# Altium schematic sheet LVDS_Receiver_CVN_CLK.SchDoc
size A4; DocumentNumber: 6; SheetNumber: 6; SheetTotal: 11
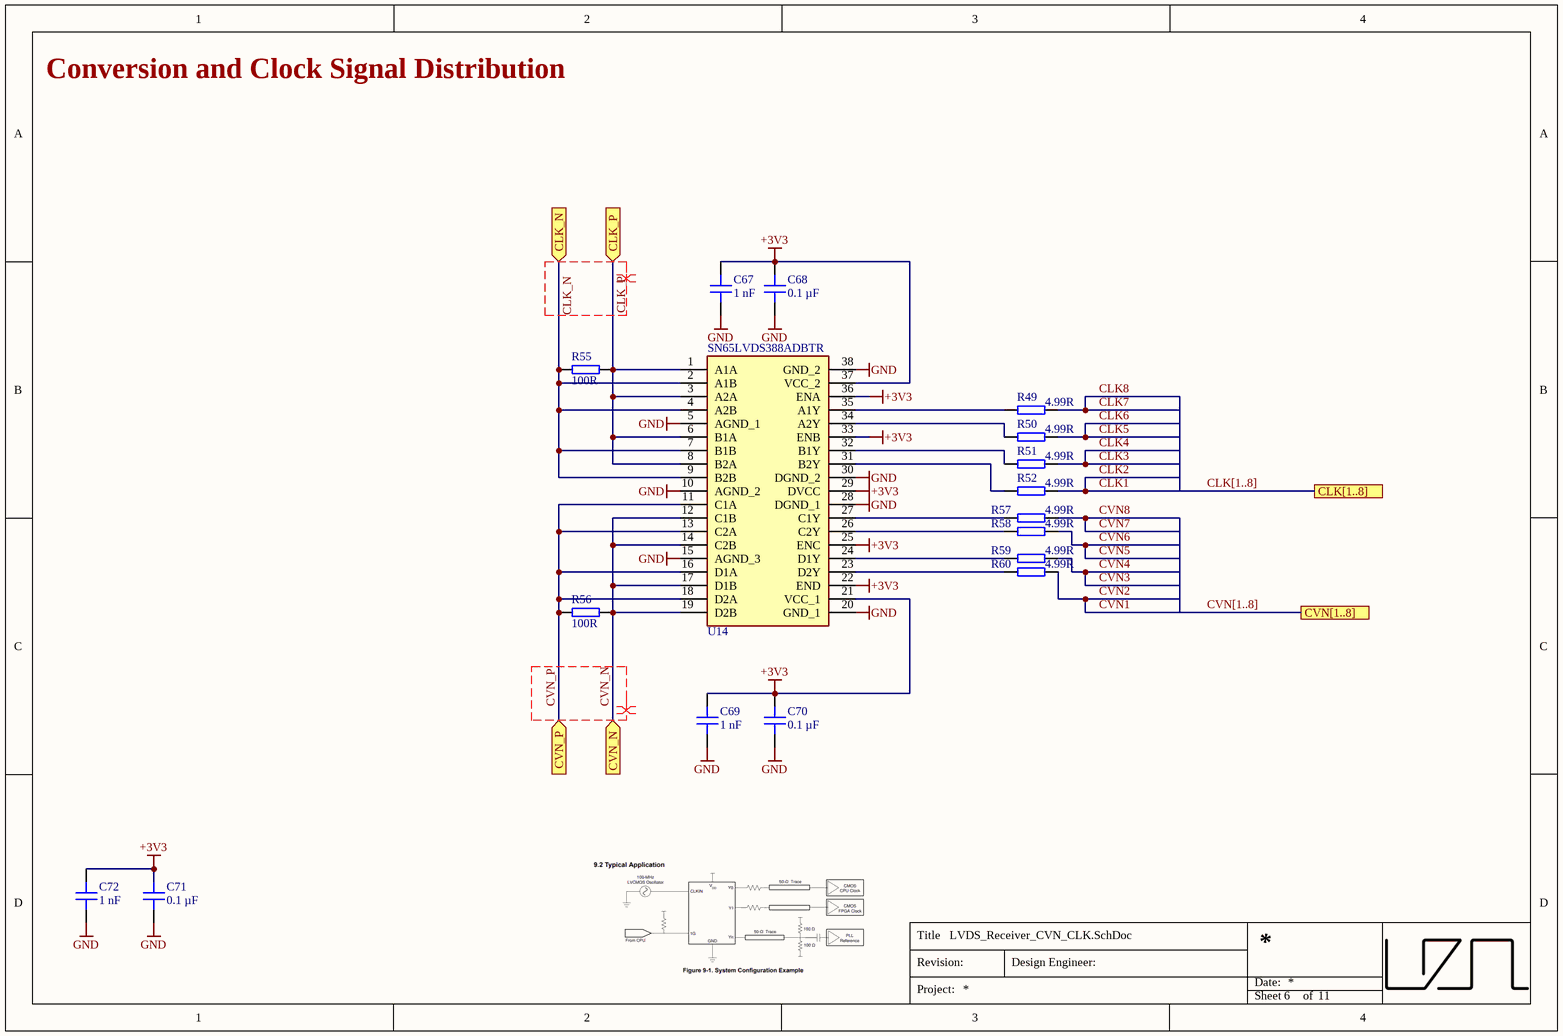
[diagram p0: LVDS_Receiver_CVN_CLK.SchDoc]

## Parts
C67  1 nF  [C_1206]
C68  0.1 µF  [C_0603]
C69  1 nF  [C_1206]
C70  0.1 µF  [C_0603]
C71  0.1 µF  [C_0603]
C72  1 nF  [C_1206]
R49  4.99R  [RES 0603_1608]
R50  4.99R  [RES 0603_1608]
R51  4.99R  [RES 0603_1608]
R52  4.99R  [RES 0603_1608]
R55  100R  [RES 0603_1608]
R56  100R  [RES 0603_1608]
R57  4.99R  [RES 0603_1608]
R58  4.99R  [RES 0603_1608]
R59  4.99R  [RES 0603_1608]
R60  4.99R  [RES 0603_1608]
U14  SN65LVDS388ADBTR  [SOP50P640X120-38N]

## Ports
CLK[1..8], CLK_N (in), CLK_P (in), CVN[1..8], CVN_N (in), CVN_P (in)

## Nets
+3V3: C67.2 C68.1 C69.2 C70.1 C71.1 C72.2 U14.21(VCC_1) U14.22(END) U14.25(ENC) U14.29(DVCC) U14.33(ENB) U14.36(ENA) U14.37(VCC_2)
GND: C67.1 C68.2 C69.1 C70.2 C71.2 C72.1 U14.5(AGND_1) U14.10(AGND_2) U14.15(AGND_3) U14.20(GND_1) U14.28(DGND_1) U14.30(DGND_2) U14.38(GND_2)
CLK1: R52.2  [also labelled CLK2]
CLK3: R51.2  [also labelled CLK4]
CLK5: R50.2  [also labelled CLK6]
CLK7: R49.2  [also labelled CLK8]
CLK_N: R55.1 U14.2(A1B) U14.4(A2B) U14.7(B1B) U14.9(B2B) ; port CLK_N
CLK_P: R55.2 U14.1(A1A) U14.3(A2A) U14.6(B1A) U14.8(B2A) ; port CLK_P
CVN1: R60.2  [also labelled CVN2]
CVN3: R59.2  [also labelled CVN4]
CVN5: R58.2  [also labelled CVN6]
CVN7: R57.2  [also labelled CVN8]
CVN_N: R56.1 U14.12(C1B) U14.14(C2B) U14.17(D1B) U14.19(D2B) ; port CVN_N
CVN_P: R56.2 U14.11(C1A) U14.13(C2A) U14.16(D1A) U14.18(D2A) ; port CVN_P
NetR49_1: R49.1 U14.35(A1Y)
NetR50_1: R50.1 U14.34(A2Y)
NetR51_1: R51.1 U14.32(B1Y)
NetR52_1: R52.1 U14.31(B2Y)
NetR57_1: R57.1 U14.27(C1Y)
NetR58_1: R58.1 U14.26(C2Y)
NetR59_1: R59.1 U14.24(D1Y)
NetR60_1: R60.1 U14.23(D2Y)

## Buses and harness runs
bus CLK[1..8] = port CLK[1..8]
bus CVN[1..8] = port CVN[1..8]

## Layout directives
differential pair: CLK_N, CLK_P, CVN_N, CVN_P

## Notes on the sheet
- Conversion and Clock Signal Distribution
- Title
- Revision:
- Design Engineer:
- Date:
- Project:
- Sheet
- of

## Library data of the parts
C67 C69 C72 = 12065C102KAT2A: Capacitor 1206, 50 VDC, 1 nF, X7R; Manufacturer: AVX; Tolerance: 10%; Voltage Rating: 50 VDC; Created from: MGremer; Manufacturer Part Number: 12065C102KAT2A; PartID: 73; Created On: 20.12.2020 13:54:13; ComponentLink1Description: Datasheet; ComponentLink1URL: https://www.mouser.de/datasheet/2/40/X7RDielectric-777024.pdf; Component Type: Capacitor 1206; Device Package: 1206; Last Updated: 18.01.2021 14:28:15; Mounting Type: SMD; Operating Temperature: -55 - 125°C; Series: MLCC X7R; Supplier 1: Mouser; Supplier Part Number 1: 581-12065C102K; Type: Capacitor; Value: 1 nF; Live Cycle Status: 1; Stock number: not stored
C68 C70 C71 = C0603X104K5RAC7411: Capacitor 0603, 50 VDC, 0.1 µF, X7R; Manufacturer: KEMET; Tolerance: 10 %; Voltage Rating: 50 VDC; Created from: MGremer; Manufacturer Part Number: C0603X104K5RAC7411; PartID: 3; Created On: 20.12.2020 13:54:13; ComponentLink1Description: Datasheet; ComponentLink1URL: https://www.mouser.de/datasheet/2/212/1/KEM_C1013_X7R_FT_CAP_SMD-1103280.pdf; Component Type: Capacitor 0603; Device Package: 0603; Last Updated: 04.03.2021 09:24:28; Mounting Type: SMD; Operating Temperature: -55 - 125°C; Series: SMD Comm X7R Flex; Supplier 1: Mouser; Supplier Part Number 1: 80-C0603X104K5R7411; Supplier 2: LCSC; Supplier Part Number 2: C14663; Type: Capacitor; Value: 0.1 µF; Live Cycle Status: 1; LCSC Part Number: C14663; Stock number: Labor SMD Container
R49-R52 R57-R60 = CRCW06034R99FKEA: SMD resistor 1%; Manufacturer: Vishay / Dale; Created from: MGremer; Manufacturer Part Number: CRCW06034R99FKEA; PartID: 178; Created On: 14.12.2020 16:17:14; ComponentLink1Description: Datasheet; ComponentLink1URL: https://www.mouser.de/datasheet/2/427/dcrcwe3-1762152.pdf; Component Type: SMD resistor; Device Package: 0603; Last Updated: 02.03.2021 14:07:32; Mounting Type: SMD; Supplier 1: Mouser; Supplier Part Number 1: 71-CRCW0603-4.99-E3; Type: Resistor; Tolerance: 1%; Value: 4.99R; Live Cycle Status: 1; Stock number: not stored
R55 R56 = AC0603FR-13100RL: SMD resistor 1%; Manufacturer: Yageo; Created from: MGremer; Manufacturer Part Number: AC0603FR-13100RL; PartID: 161; Created On: 14.12.2020 16:17:14; ComponentLink1Description: Datasheet; ComponentLink1URL: https://www.mouser.de/datasheet/2/447/PYu-AC_51_RoHS_L_7-1714230.pdf; Component Type: SMD resistor; Device Package: 0603; Last Updated: 02.03.2021 14:07:32; Mounting Type: SMD; Supplier 1: Mouser; Supplier Part Number 1: 603-AC0603FR-13100RL; Type: Resistor; Tolerance: 1%; Value: 100R; Live Cycle Status: 1; Stock number: not stored
U14 = SN65LVDS388ADBTR: High-Speed Differential Line Receivers; Manufacturer_Name: Texas Instruments; Manufacturer: TI; Created from: MHlatky; Datasheet Link: http://www.ti.com/lit/gpn/SN65LVDS388A; Height: 1.2mm; Manufacturer_Part_Number: SN65LVDS388ADBTR; Manufacturer Part Number: SN65LVDS388ADBTR; PartID: 9; Created On: 03.03.2022 16:53:36; ComponentLink1Description: Datasheet; ComponentLink1URL: https://www.ti.com/lit/ds/symlink/sn65lvds388a.pdf?HQS=dis-mous-null-mousermode-dsf-pf-null-wwe&ts=1646514254859&ref_url=https%253A%252F%252Fwww.mouser.de%252F; Component Type: SN65LVDS388ADBTR; Last Updated: 08.03.2022 12:13:05; Mounting Type: SOP; Operating Temperature: -40 - 85; Supplier 1: Mouser; Supplier Part Number 1: 595-SN65LVDS388ADBTR; Type: LVDS Interface; Live Cycle Status: 1